# Altium schematic sheet wifi_isolated.SchDoc: Isolated_Wifi
size A4; Organization: UNSW Solar Racing Team; Address3: UNSW; Address4: Sydney NSW 2052; Address2: Electrical Engineering; Address1: Room 342
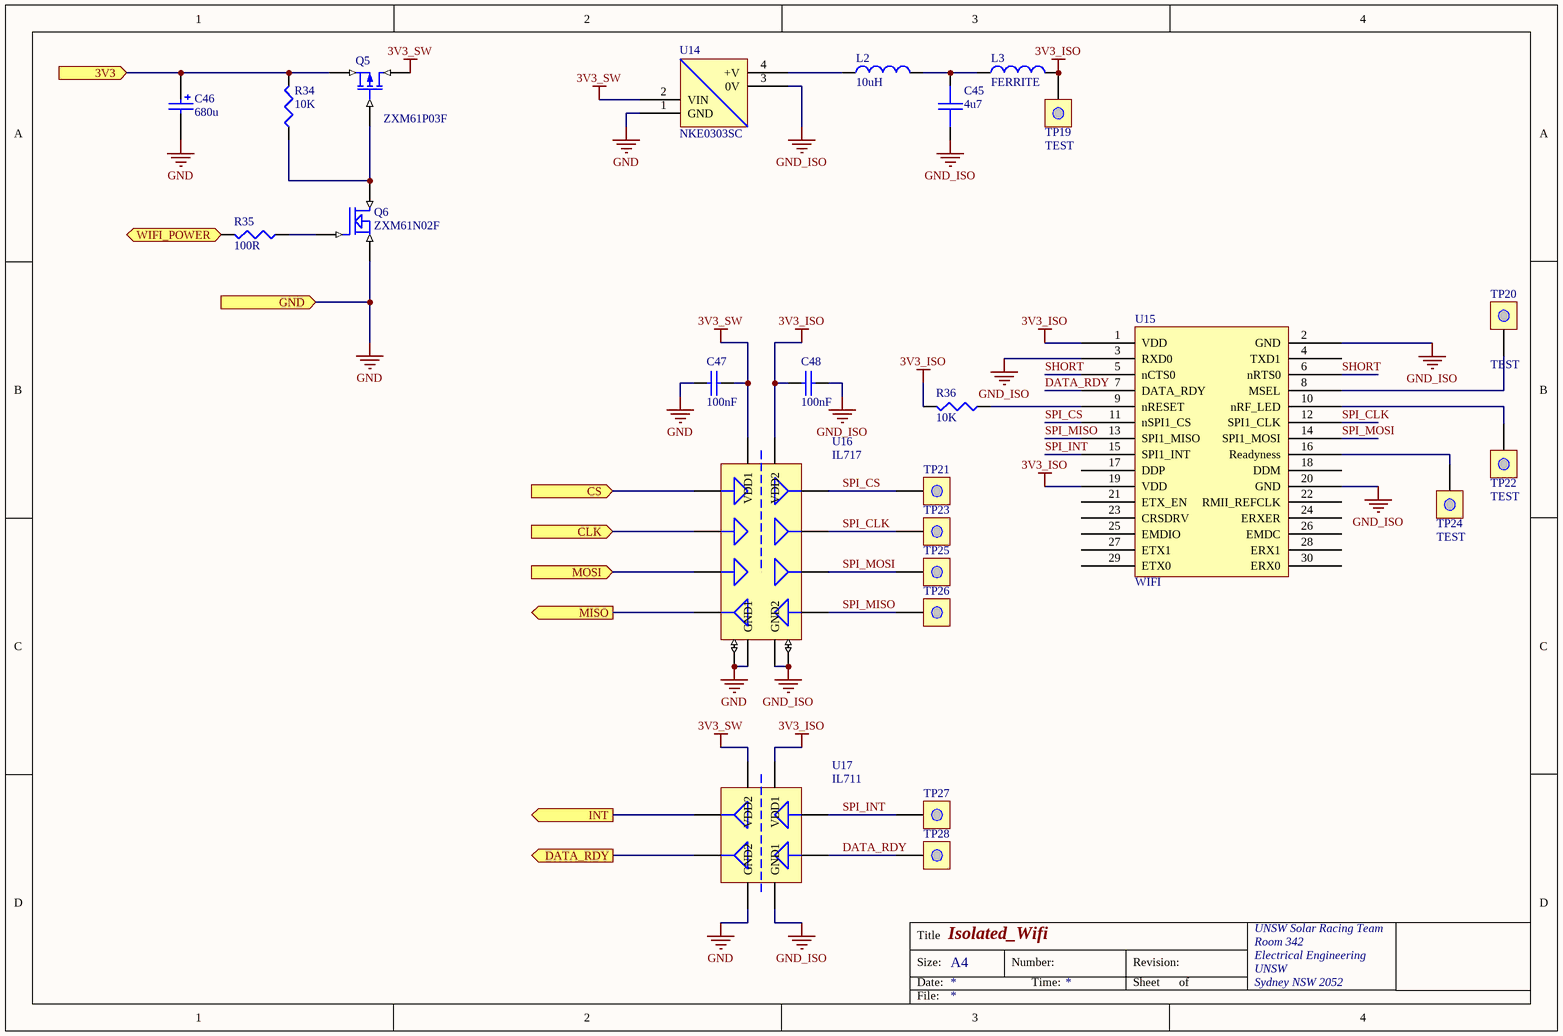
[diagram p0: wifi_isolated.SchDoc]

## Parts
C45  4u7  [0805]
C46  680u  [MCCT-CASED]
C47  100nF  [0603]
C48  100nF  [0603]
L2  10uH  [1100R]
L3  FERRITE  [0603]
Q5  ZXM61P03F  [SOT23-3]
Q6  ZXM61N02F  [SOT23-3]
R34  10K  [0603]
R35  100R  [0603]
R36  10K  [0603]
TP19  TEST  [TESTPOINT]
TP20  TEST  [TESTPOINT]
TP21  TEST  [TESTPOINT]  (value not drawn)
TP22  TEST  [TESTPOINT]
TP23  TEST  [TESTPOINT]  (value not drawn)
TP24  TEST  [TESTPOINT]
TP25  TEST  [TESTPOINT]  (value not drawn)
TP26  TEST  [TESTPOINT]  (value not drawn)
TP27  TEST  [TESTPOINT]  (value not drawn)
TP28  TEST  [TESTPOINT]  (value not drawn)
U14  NKE0303SC  [NPSIP4]
U15  WIFI  [NANO_WIREACH]
U16  IL717  [SO16]
U17  IL711  [SO8]

## Ports
3V3 (in), CLK (in), CS (in), DATA_RDY (out), GND (in), INT (out), MISO (out), MOSI (in), WIFI_POWER (in)

## Nets
3V3_ISO: C48.2 L3.2 R36.2 TP19.0(TP) U15.1(VDD) U15.19(VDD) U16.16(VDD2) U17.1(VDD1)
3V3_SW: C47.2 Q5.2(S) U14.2(VIN) U16.1(VDD1) U17.8(VDD2)
GND: C46.2 C47.1 Q6.2(S) U14.1(GND) U16.2(GND1) U16.8(GND1) U17.5(GND2) ; port GND
GND_ISO: C45.2 C48.1 U14.3(0V) U15.2(GND) U15.3(RXD0) U15.20(GND) U16.9(GND2) U16.15(GND2) U17.4(GND1)
3V3: C46.1 Q5.3(D) R34.2 ; port 3V3
CLK: U16.4(IN2) ; port CLK
CS: U16.3(IN1) ; port CS
DATA_RDY: TP28.0(TP) U15.7(DATA_RDY) U17.3(IN2)
DATA_RDY: U17.6(OUT2) ; port DATA_RDY  [a separate net that carries the same name]
INT: U17.7(OUT1) ; port INT
MISO: U16.6(OUT4) ; port MISO
MOSI: U16.5(IN3) ; port MOSI
SHORT: U15.5(nCTS0) U15.6(nRTS0)
SPI_CLK: TP23.0(TP) U15.12(SPI1_CLK) U16.13(OUT2)
SPI_CS: TP21.0(TP) U15.11(nSPI1_CS) U16.14(OUT1)
SPI_INT: TP27.0(TP) U15.15(SPI1_INT) U17.2(IN1)
SPI_MISO: TP26.0(TP) U15.13(SPI1_MISO) U16.11(IN4)
SPI_MOSI: TP25.0(TP) U15.14(SPI1_MOSI) U16.12(OUT3)
WIFI_POWER: R35.2 ; port WIFI_POWER
NetC45_1: C45.1 L2.2 L3.1
NetL2_1: L2.1 U14.4(+V)
NetQ5_1: Q5.1(G) Q6.3(D) R34.1
NetQ6_1: Q6.1(G) R35.1
NetR36_1: R36.1 U15.9(nRESET)
NetTP20_0: TP20.0(TP) U15.8(MSEL)
NetTP22_0: TP22.0(TP) U15.10(nRF_LED)
NetTP24_0: TP24.0(TP) U15.16(Readyness)

Not connected (* = marked no-connect by the designer): U15 4(TXD1) 17(DDP) 18(DDM) 21(ETX_EN) 22(RMII_REFCLK) 23(CRSDRV) 24(ERXER) 25(EMDIO) 26(EMDC) 27(ETX1) 28(ERX1) 29(ETX0) 30(ERX0)

## Notes on the sheet
- Title
- Size:
- Date:
- A4
- Number:
- Time:
- Revision:
- Sheet
- of
- File:

## Library data of the parts
C45 C47 C48 = CAP: Capacitor
  C45: Farnell: 1683997; Price: 0.05
  C47 C48: Farnell: 753-567; Price: 0.31
C46 = CAP POL3: Polarized Capacitor (Surface Mount); Manufacturer: Generic Components; Class I: Passive; Value: 100pF; Published: 8-Jun-2000; Revision: July-2002: Re-released for DXP Platform.; Publisher: Altium Limited; Class II: Capacitor
L2 = INDUCTOR: 11R103C Murata Inductor; Manufacturer: Generic Components; Class I: Passive; Value: 10mH; Published: 8-Jun-2000; Revision: July-2002: Re-released for DXP Platform.; Publisher: Altium Limited; Class II: Inductor; Farnell: 1710415; Price: 0.701
L3 = INDUCTOR: Manufacturer: Generic Components; Class I: Passive; Published: 8-Jun-2000; Revision: July-2002: Re-released for DXP Platform.; Publisher: Altium Limited; Class II: Inductor; Farnell: *; Value: *; Farnell: 323-7977; Price: 0.698
Q5 = ZXM61P03F: 1.1A, 30V P-Channel Enhancement mode FET
Q6 = ZXM61N02F: 1.7A, 20V N-Channel Enhancement mode FET
R34-R36 = RES1: Resistor
TP19-TP28 = TEST: TEST POINT
U14 = LME1205S(4): 1W subminiature DC/DC; Part Field 1: 1175765; Part Field 2: 25.12; Part Field 3: Farnell
U15 = NANO_WIREACH: ConnectOne Nano WiReach wifi module; Connector: Farnell 1567709
U16 = IL717: Isoloop IL717 - www.nve.com
U17 = IL711: IL711 Optical Isolator